# EAGLE design THzChipCarrierBoard (EAGLE 9.5.2)
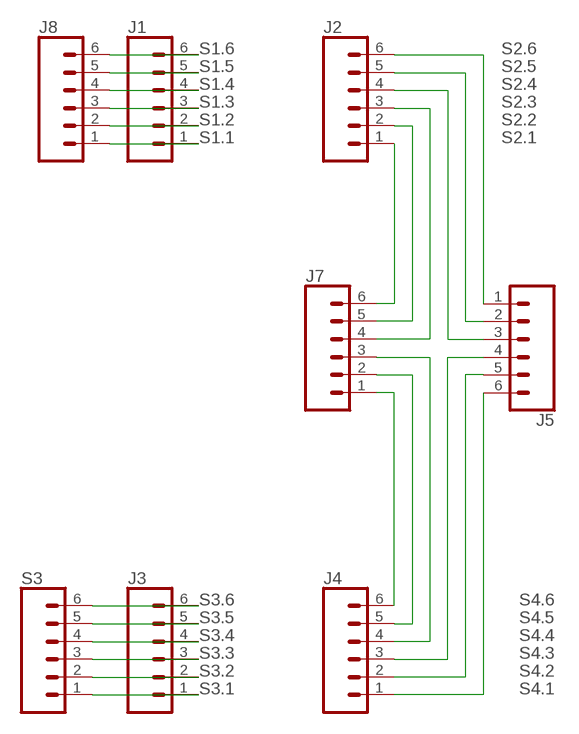
[diagram p0: schematic, sheet 1]

## Parts
J1  CONN_06SILK_FEMALE_PTH  [1X06]
J2  CONN_06SILK_FEMALE_PTH  [1X06]
J3  CONN_06SILK_FEMALE_PTH  [1X06]
J4  CONN_06SILK_FEMALE_PTH  [1X06]
J5  CONN_06SILK_FEMALE_PTH  [1X06]
J7  CONN_06SILK_FEMALE_PTH  [1X06]
J8  CONN_06SILK_FEMALE_PTH  [1X06]
S3  CONN_06SILK_FEMALE_PTH  [1X06]

## Nets
S1.1: J1.1 J8.1
S1.2: J1.2 J8.2
S1.3: J1.3 J8.3
S1.4: J1.4 J8.4
S1.5: J1.5 J8.5
S1.6: J1.6 J8.6
S2.1: J2.1 J7.6
S2.2: J2.2 J7.5
S2.3: J2.3 J7.4
S2.4: J2.4 J5.3
S2.5: J2.5 J5.2
S2.6: J2.6 J5.1
S3.1: J3.1 S3.1
S3.2: J3.2 S3.2
S3.3: J3.3 S3.3
S3.4: J3.4 S3.4
S3.5: J3.5 S3.5
S3.6: J3.6 S3.6
S4.1: J4.1 J5.6
S4.2: J4.2 J5.5
S4.3: J4.3 J5.4
S4.4: J4.4 J7.3
S4.5: J4.5 J7.2
S4.6: J4.6 J7.1

## Library data of the parts
J1-J5 J7 J8 S3 = SparkFun-Connectors:CONN_06: Multi connection point. Often used as Generic Header-pin footprint for 0.1 inch spaced/style header connections On any of the 0.1 inch spaced packages, you can populate with these: Break Away Headers - Straight <https://www.sparkfun.com/products/116> (PRT-00116) Break Away Male Headers - Right Angle <https://www.sparkfun.com/products/553> (PRT-00553) Female Headers <https://www.sparkfun.com/products/115> (PRT-00115) Break Away Headers - Machine Pin <https://www.sparkfun.com/products/117> (PRT-00117) Break Away Female Headers - Swiss Machine Pin <https://www.sparkfun.com/products/743> (PRT-00743) Arduino Stackable Header - 6 Pin <https://www.sparkfun.com/products/9280> (PRT-09280) For SCREWTERMINALS and SPRING TERMINALS visit here: Screw Terimnals on SparkFun.com <https://www.sparkfun.com/search/results?term=Screw+Terminals> (5mm/3.5mm/2.54mm spacing) This device is also useful as a general connection point to wire up your design to another part of your project. Our various solder wires solder well into these plated through hole pads. Hook-Up Wire - Assortment (Stranded, 22 AWG) <https://www.sparkfun.com/products/11375> (PRT-11375) Hook-Up Wire - Assortment (Solid Core, 22 AWG) <https://www.sparkfun.com/products/11367> (PRT-11367) View the entire wire category on our website here <https://www.sparkfun.com/categories/141>; OC_FARNELL: unknown; PROD_ID: CONN-08437

## Board
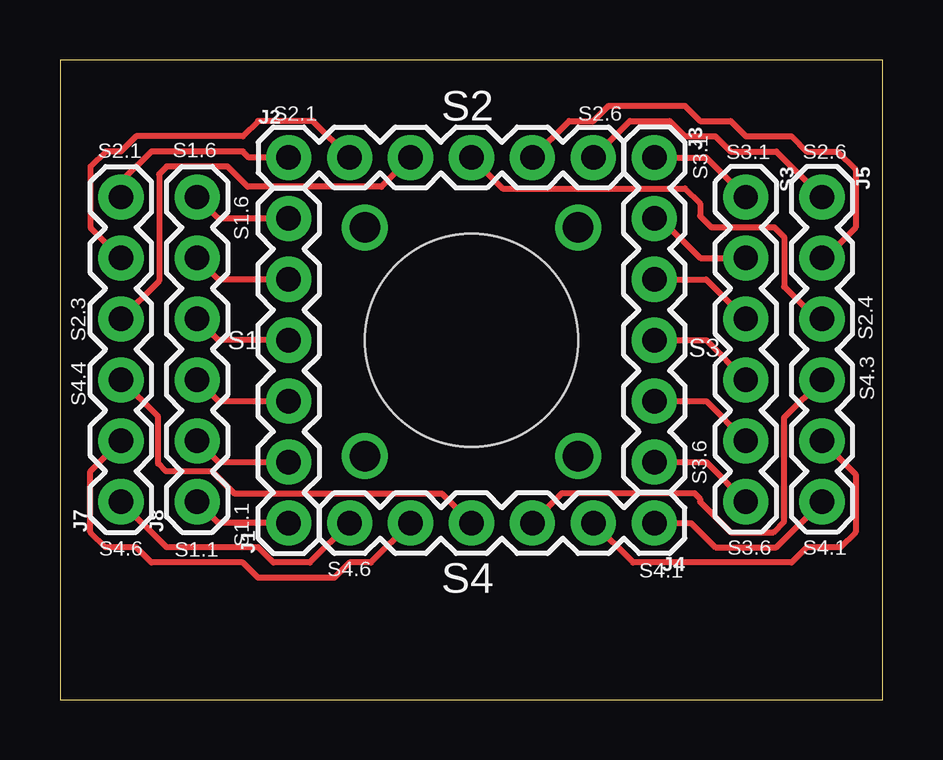
[diagram p1: board, top side]
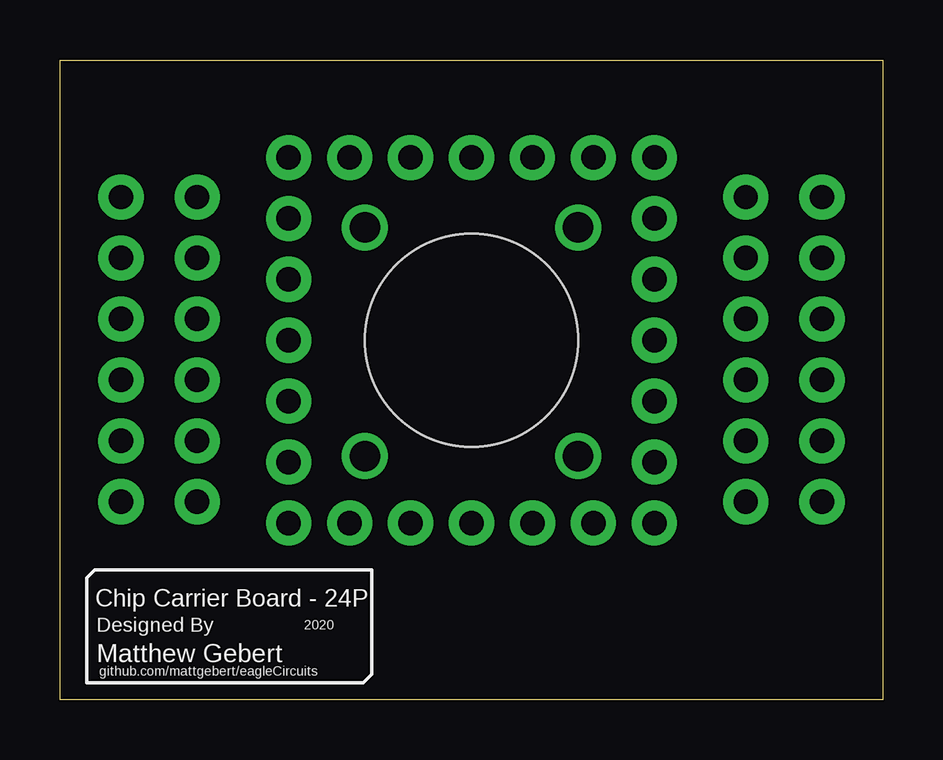
[diagram p2: board, bottom side, seen from below]

Size 34.29 x 26.67 mm. Coordinates in mm from the lower left corner, seen from the top.
Outline: 0,0 34.29,0 34.29,26.67 0,26.67 0,0
Copper layers (1*16): Top 0.035mm / dielectric 1.5mm / Bottom 0.035mm
Design rules "default": minimum track width 6mil, minimum drill 0.35mm, track to track 6mil, track to pad 6mil, pad to pad 6mil, via to via 6mil, smd to smd 6mil, copper to edge 40mil, drill to drill 6mil, minimum pad ring 10mil, minimum via ring 8mil, stop-mask expansion 4mil, vias tented up to drill 0mil, thermal gap 10mil
Holes 8.89 mm at 17.14,14.99

### Footprints (pad centres in the part's own frame; a part is rotated, then mirrored left to right if it is on the bottom)
1X06 = drill 1.016 pad 1.88: 1 0,0; 2 2.54,0; 3 5.08,0; 4 7.62,0; 5 10.16,0; 6 12.7,0

### Placement (x,y rotation side)
J1  9.53,7.37 90 top
J2  9.53,22.61 0 top
J3  24.76,22.61 270 top
J4  24.76,7.37 180 top
J5  31.75,20.95 270 top
J7  2.54,8.26 90 top
J8  5.71,8.26 90 top
S3  28.57,20.95 270 top

### Tracks (layer width: path | path; a pad name or v marks a point on that pad's centre or on a via)
N$1  (via drill 1.27)
  other vias: 12.7,19.68
N$2  (via drill 1.27)
  other vias: 21.59,19.68
N$3  (via drill 1.27)
  other vias: 21.59,10.16
N$4  (via drill 1.27)
  other vias: 12.7,10.16
S1.1
  Top 0.254: J8.1 6.6,7.37 J1.1
S1.2
  Top 0.254: J1.2 6.6,9.91 J8.2
S1.3
  Top 0.254: J8.3 6.6,12.45 J1.3
S1.4
  Top 0.254: J8.4 6.6,14.99 J1.4
S1.5
  Top 0.254: J8.5 6.6,17.53 J1.5
S1.6
  Top 0.254: J8.6 6.6,20.07 J1.6
S2.1
  Top 0.254: J2.1 7.87,22.61 7.62,22.86 3.81,22.86 2.54,21.59 J7.6
S2.2
  Top 0.254: J2.2 10.54,24.13 8.26,24.13 7.62,23.5 3.17,23.5 2.54,22.86 1.91,22.86 1.27,22.23 1.27,19.68 J7.5
S2.3
  Top 0.254: J7.4 4.13,17.46 4.13,21.91 4.45,22.23 6.99,22.23 7.82,21.39 13.39,21.39 J2.3
S2.4
  Top 0.254: J2.4 18.44,21.31 26.04,21.31 26.67,20.68 26.67,20.17 27.14,19.7 29.77,19.7 30.17,19.29 30.17,17.22 31.52,15.88 J5.3
S2.5
  Top 0.254: J2.5 21.21,24.13 22.22,24.13 22.86,24.77 26.04,24.77 26.67,24.13 27.94,24.13 28.57,23.5 30.48,23.5 31.11,22.86 32.39,22.86 33.15,22.1 33.15,19.68 31.88,18.41 J5.2
S2.6
  Top 0.254: J2.6 23.75,24.13 25.4,24.13 26.04,23.5 27.3,23.5 27.94,22.86 29.84,22.86 J5.1
S3.1
  Top 0.254: J3.1 26.92,22.61 S3.1
S3.2
  Top 0.254: J3.2 25.02,20.07 26.67,18.41 S3.2
S3.3
  Top 0.254: J3.3 26.92,17.53 S3.3
S3.4
  Top 0.254: J3.4 26.92,14.99 S3.4
S3.5
  Top 0.254: J3.5 26.92,12.45 S3.5
S3.6
  Top 0.254: J3.6 26.92,9.91 S3.6
S4.1
  Top 0.254: J4.1 26.29,7.37 27.3,6.35 29.84,6.35 J5.6
S4.2
  Top 0.254: J5.5 33.15,9.4 33.15,6.99 32.51,6.35 31.11,6.35 30.48,5.71 23.88,5.71 J4.2
S4.3
  Top 0.254: J4.3 20.93,8.61 26.43,8.61 26.67,8.37 26.67,8.26 27.94,6.99 29.73,6.99 30.17,7.43 30.17,11.76 J5.4
S4.4
  Top 0.254: J4.4 15.93,8.59 7.29,8.59 6.35,9.53 4.41,9.53 4.09,9.84 4.09,11.8 2.55,13.34 J7.3
S4.5
  Top 0.254: J4.5 12.95,5.71 12.06,5.71 11.43,5.08 8.26,5.08 7.62,5.71 3.81,5.71 3.17,6.35 1.91,6.35 1.27,6.99 1.27,9.53 J7.2
S4.6
  Top 0.254: J4.6 10.41,5.71 8.89,5.71 8.26,6.35 4.45,6.35 J7.1

### Text on the board
tPlace: S2.1 | S2 | S2.6 | S2.1 | S1.6 | S3.1 | S2.6 | S3.1 | S1.6 | S2.3 | S1 | S2.4 | S3 | S4.4 | S4.3 | S3.6 | S4.6 | S1.1 | S1.1 | S3.6 | S4.1 | S4.6 | S4.1 | S4
bPlace: Chip Carrier Board - 24P | 2020 | Designed By | Matthew Gebert | github.com/mattgebert/eagleCircuits